# Altium schematic sheet Misc.SchDoc
size 431 x 279 mm; Organization: ORGANIZATION; Address1: ADDRESS 1; Address2: ADDRESS 2; Address3: ADDRESS 3; Address4: ADDRESS 4; Revision: -; SheetNumber: 7; SheetTotal: 7; ENG_APP_DATE: --/--/--; DSN_APP_DATE: --/--/--; CHK_APP_DATE: --/--/--
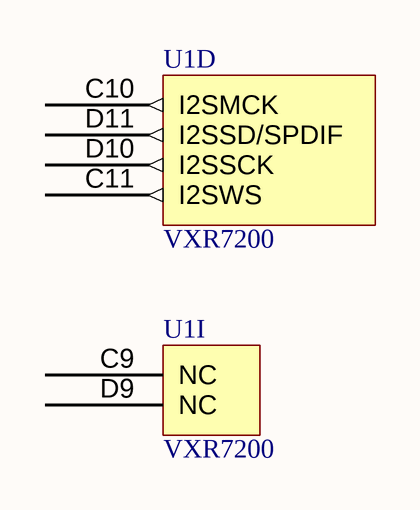
[diagram p0: Misc.SchDoc]

## Parts
U1  VXR7200  [BGA100P9X9-81A]  (parts D,I of 9)

## Nets

Not connected (* = marked no-connect by the designer): U1 C9(NC_) C10(I2SMCK_) C11(I2SWS_) D9(NC_) D10(I2SSCK_) D11(I2SSD/SPDIF_)

## Notes on the sheet
- DWG. NO.
- REV.
- SHT.
- REVISION
- DESCRIPTION
- DATE
- APPROVED
- ENG:
- APPROVALS
- PROJECT
- DSN:
- CHK:
- REFERENCE DOCUMENTS
- PROJECT REVISION:
- TITLE
- SimulaVR
- DOCUMENT REVISION:
- DESIGN ITEM:
- BOM:
- FAB DWG:
- PCB DWG:
- ASSY DWG:
- SCALE:
- SIZE
- B
- CAGE CODE
- FILE NAME
- DWG NO.
- SHEET
- OF
- REV

## Library data of the parts
U1 = CMP-015-00008-4: VXR7200 DP to MIPI-DSI bridge